# Altium project 3 Breakout Board.PrjPcb
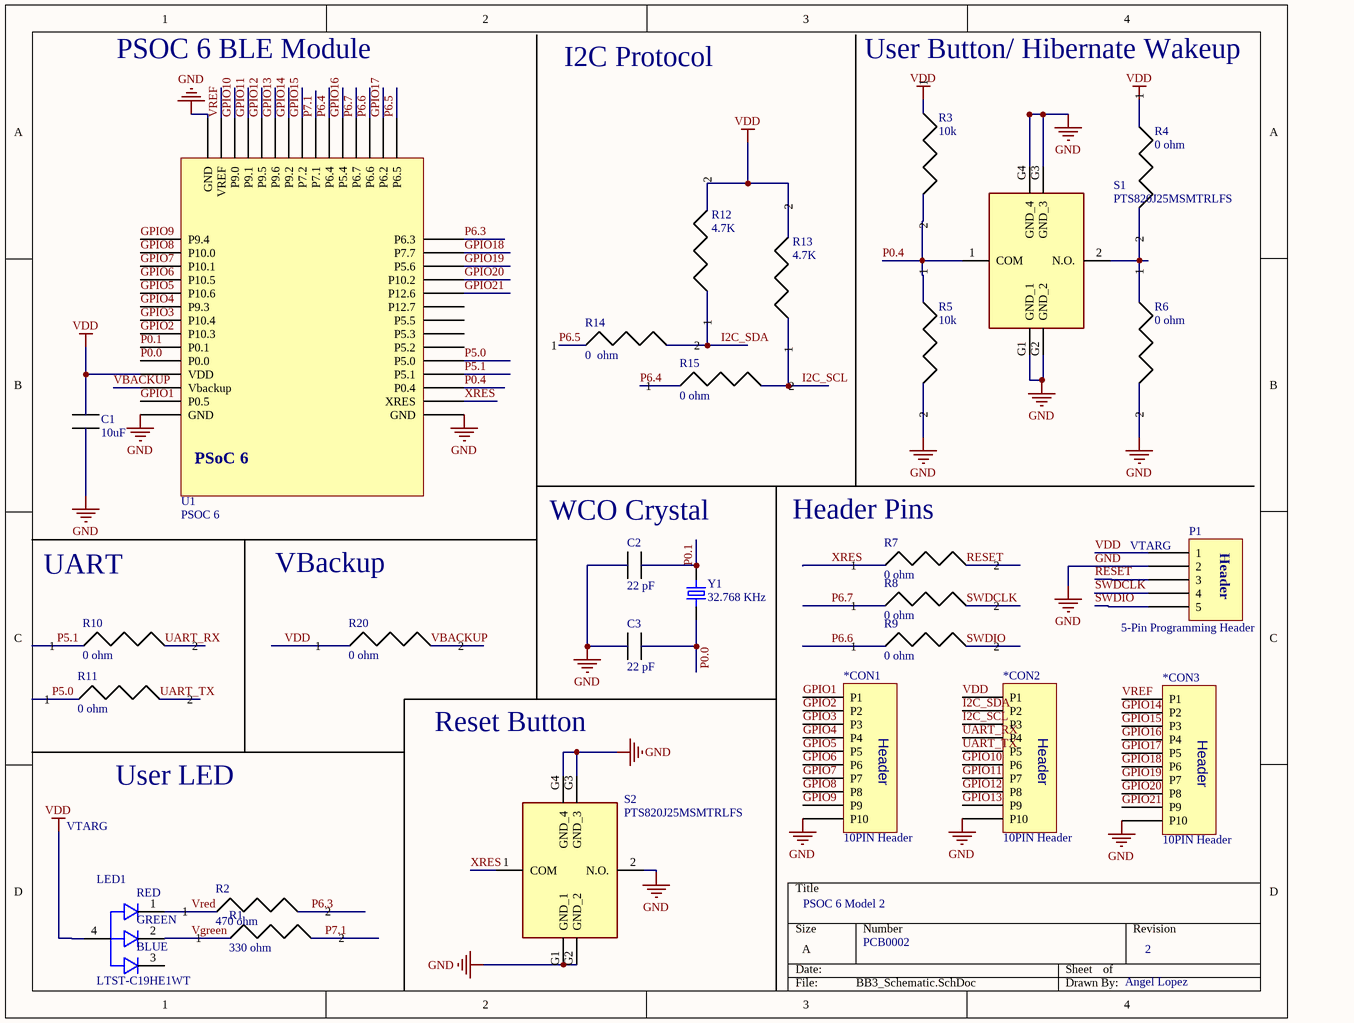
[diagram p0: BB3_Schematic.SchDoc]
1 sheet, 28 parts. Net scope: global (net labels, ports and power ports of the same name join across sheets).
Board files: BB3_PCB.PcbDoc, PSOC_PCB.PcbDoc

## Sheet BB3_Schematic.SchDoc
size A; SheetNumber: 1; SheetTotal: 1

### Parts
*CON1  10PIN Header  [10 Pin Header]
*CON2  10PIN Header  [10 Pin Header]
*CON3  10PIN Header  [10 Pin Header]
C1  10uF  [Capacitor]
C2  22 pF  [Capacitor]
C3  22 pF  [Capacitor]
LED1  LTST-C19HE1WT  [LED_LTST-C19HE1WT]
P1  5-Pin Programming Header  [5pin Progamming Header]
R1  330 ohm  [Resistor]
R2  470 ohm  [Resistor]
R3  10k  [Resistor]
R4  0 ohm  [Resistor]
R5  10k  [Resistor]
R6  0 ohm  [Resistor]
R7  0 ohm  [Resistor]
R8  0 ohm  [Resistor]
R9  0 ohm  [Resistor]
R10  0 ohm  [Resistor]
R11  0 ohm  [Resistor]
R12  4.7K  [Resistor]
R13  4.7K  [Resistor]
R14  0  ohm  [Resistor]
R15  0 ohm  [Resistor]
R20  0 ohm  [Resistor]
S1  PTS820J25MSMTRLFS  [PTS820J25MSMTRLFS]
S2  PTS820J25MSMTRLFS  [PTS820J25MSMTRLFS]
U1  PSOC 6  [PSoC 6]
Y1  32.768 KHz  [ECX-31B]

### Nets
GND: *CON1.P10 *CON2.P10 *CON3.P10 C1.2 C2.1 C3.1 P1.2 R5.2 R6.2 S1.G1(GND_1) S1.G2(GND_2) S1.G3(GND_3) S1.G4(GND_4) S2.2(N.O.) S2.G1(GND_1) S2.G2(GND_2) S2.G3(GND_3) S2.G4(GND_4) U1.GND
VDD: *CON2.P1 C1.1 LED1.4 P1.1 R3.1 R4.1 R12.2 R13.2 R20.1 U1.VDD
GPIO1: *CON1.P1 U1.P0.5
GPIO2: *CON1.P2 U1.P10.3
GPIO3: *CON1.P3 U1.P10.4
GPIO4: *CON1.P4 U1.P9.3
GPIO5: *CON1.P5 U1.P10.6
GPIO6: *CON1.P6 U1.P10.5
GPIO7: *CON1.P7 U1.P10.1
GPIO8: *CON1.P8 U1.P10.0
GPIO9: *CON1.P9 U1.P9.4
GPIO10: *CON2.P6 U1.P9.0
GPIO11: *CON2.P7 U1.P9.1
GPIO12: *CON2.P8 U1.P9.5
GPIO13: *CON2.P9 U1.P9.6
GPIO14: *CON3.P2 U1.P9.2
GPIO15: *CON3.P3 U1.P7.2
GPIO16: *CON3.P4 U1.P5.4
GPIO17: *CON3.P5 U1.P6.2
GPIO18: *CON3.P6 U1.P7.7
GPIO19: *CON3.P7 U1.P5.6
GPIO20: *CON3.P8 U1.P10.2
GPIO21: *CON3.P9 U1.P12.6
I2C_SCL: *CON2.P3 R13.1 R15.2
I2C_SDA: *CON2.P2 R12.1 R14.2
P0.0: C3.2 U1.P0.0 Y1.1
P0.1: C2.2 U1.P0.1 Y1.2
P0.4: R3.2 R5.1 S1.1(COM) U1.P0.4
P5.0: R11.1 U1.P5.0
P5.1: R10.1 U1.P5.1
P6.3: R2.2 U1.P6.3
P6.4: R15.1 U1.P6.4
P6.5: R14.1 U1.P6.5
P6.6: R9.1 U1.P6.6
P6.7: R8.1 U1.P6.7
P7.1: R1.2 U1.P7.1
RESET: P1.3 R7.2
SWDCLK: P1.4 R8.2
SWDIO: P1.5 R9.2
UART_RX: *CON2.P4 R10.2
UART_TX: *CON2.P5 R11.2
VBACKUP: R20.2 U1.Vbackup
Vgreen: LED1.2 R1.1
Vred: LED1.1 R2.1
VREF: *CON3.P1 U1.VREF
XRES: R7.1 S2.1(COM) U1.XRES
NetR4_2: R4.2 R6.1 S1.2(N.O.)

Not connected (* = marked no-connect by the designer): LED1 3; U1 P5.2 P5.3 P5.5 P12.7

### Notes on the sheet
- PSOC 6 BLE Module
- I2C Protocol
- User Button/ Hibernate Wakeup
- WCO Crystal
- (near R7) Header Pins
- (near P1) VTARG
- UART
- VBackup
- Reset Button
- VTARG
- User LED
- PSOC 6 Model 2
- PCB0002
- 2
- Angel Lopez
- (in symbol 5-Pin Programming Header) Header
- (in symbol 10PIN Header) Header
- (in symbol LTST-C19HE1WT) RED; GREEN; BLUE
- (in symbol PSOC 6) PSoC 6

### Library data of the parts
C1-C3 = Cap 0603
LED1 = LTST-C19HE1WT: Red, Green, Blue _RGB_ 624nm Red, 525nm Green, 470nm Blue LED Indication - Discrete 2.1V Red, 3.35V Green, 3.35V Blue 0606 _1616 Metric_; MF: Lite-On Inc.; MP: LTST-C19HE1WT; Value: *; SnapEDA_Link: https://www.snapeda.com/parts/LTST-C19HE1WT/Lite-On%20Inc./view-part/423425/?ref=snap; Price: None; Package: 0606 Lite-On; Availability: Unavailable
R1-R15 R20 = Resistor
S1 S2 = PTS820J25MSMTRLFS: Switch; Manufacturer_Name: C & K COMPONENTS; Datasheet Link: https://www.ckswitches.com/media/1474/pts820.pdf; Height: 1.5mm; Manufacturer_Part_Number: PTS820J25MSMTRLFS; Mouser Part Number: 611-PTS820J25MSMTR; Mouser Price/Stock: https://www.mouser.co.uk/ProductDetail/CK/PTS820J25MSMTRLFS?qs=UxeAxwACbqmM7fS1sTfuhg%3D%3D
Y1 = ECX-31B: The miniature ECX-31B is the most cost effective SMD Tuning / Fork Crystal today. The 3.2 x 1.5 x 0.9 mm ceramic package is / ideal high density circuit boards. Offerings in extended / temperature and frequency tolerance as low at ±10 ppm.